# Altium schematic sheet power.SchDoc
size A4; DocumentNumber: 7; SheetNumber: 7; SheetTotal: 8
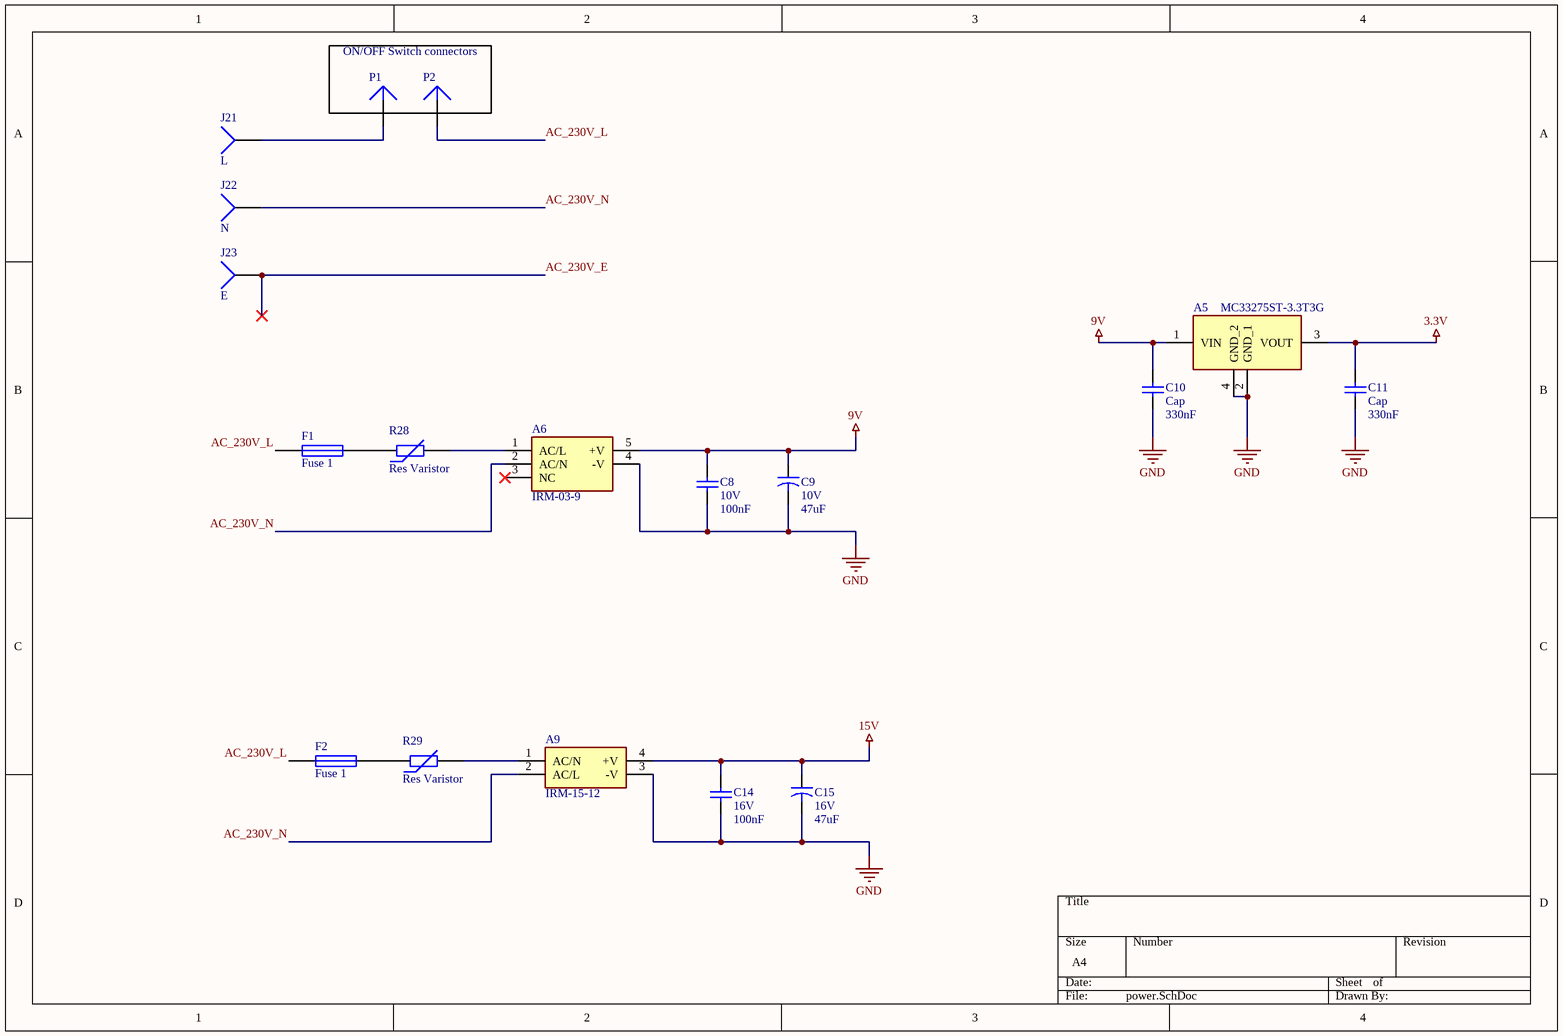
[diagram p0: power.SchDoc]

## Parts
A5  MC33275ST-3.3T3G  [SOT230P700X175-4N]
A6  IRM-03-9  [IRM039]
A9  IRM-15-12  [IRM-15-12]
C8  10V  value 100nF  [6-0805_L]
C9  10V  value 47uF  [CAPAE830X1050N]
C10  Cap  value 330nF  [6-0805_L]
C11  Cap  value 330nF  [6-0805_L]
C14  16V  value 100nF  [6-0805_L]
C15  16V  value 47uF  [CAPAE830X1050N]
F1  Fuse 1  [0751.0056]
F2  Fuse 1  [0751.0056]
J21  L  [PIN1]
J22  N  [PIN1]
J23  E  [PIN1]
P1  Plug  [PIN1]  (value not drawn)
P2  Plug  [PIN1]  (value not drawn)
R28  Res Varistor  [CAPR5-4X5]
R29  Res Varistor  [CAPR5-4X5]

## Blocks framed on the sheet
ON/OFF Switch connectors: P1 P2

## Nets
3.3V: A5.3(VOUT) C11.2
9V: A5.1(VIN) A6.5(+V) C8.2 C9.1 C10.2
15V: A9.4(+V) C14.2 C15.1
GND: A5.2(GND_1) A5.4(GND_2) A6.4(-V) A9.3(-V) C8.1 C9.2 C10.1 C11.1 C14.1 C15.2
AC_230V_E: J23.1
AC_230V_L: F1.1 F2.1 P2.1
AC_230V_N: A6.2(AC/N) A9.2(AC/L) J22.1
NetA6_1: A6.1(AC/L) R28.2
NetA9_1: A9.1(AC/N) R29.2
NetF1_2: F1.2 R28.1
NetF2_2: F2.2 R29.1
NetJ21_1: J21.1 P1.1

Not connected (* = marked no-connect by the designer): A6 3(NC)*

## Library data of the parts
A5 = MC33275ST-3.3T3G: Integrated Circuit; Manufacturer_Name: ON Semiconductor; Allied_Number: 70340056; Datasheet Link: http://www.onsemi.com/pub/Collateral/MC33275-D.PDF; Height: 1.75mm; Manufacturer_Part_Number: MC33275ST-3.3T3G; Mouser Part Number: 863-MC33275ST-3.3T3G; Mouser Price/Stock: https://www.mouser.com/Search/Refine.aspx?Keyword=863-MC33275ST-3.3T3G; RS Part Number: 7856910P; RS Price/Stock: http://uk.rs-online.com/web/p/products/7856910P; Allied Price/Stock: https://www.alliedelec.com/on-semiconductor-mc33275st-3-3t3g/70340056/
A6 = IRM-03-9: Power Supply; Manufacturer_Name: Mean Well; Allied_Number: 70879802; Datasheet Link: https://componentsearchengine.com/Datasheets/2/IRM-03-9.pdf; Height: 15mm; Manufacturer_Part_Number: IRM-03-9; Mouser Part Number: 709-IRM03-9; Mouser Price/Stock: https://www.mouser.com/Search/Refine.aspx?Keyword=709-IRM03-9; RS Part Number: 1359235P; RS Price/Stock: http://uk.rs-online.com/web/p/products/1359235P; Allied Price/Stock: https://www.alliedelec.com/meanwellusa-irm-03-9/70879802/
A9 = IRM-15-12: Power Supply; Manufacturer_Name: Mean Well; Datasheet Link: https://www.meanwell-web.com/content/files/pdfs/productPdfs/MW/IRM-15-spec.pdf; Mouser2 Part Number: 709-IRM15-12; Mouser2 Price/Stock: https://www.mouser.com/Search/Refine.aspx?Keyword=709-IRM15-12; Manufacturer_Part_Number: IRM-15-12
C8 C10 C11 C14 = Cap: Capacitor; Published: 8-Jun-2000; LatestRevisionDate: 17-Jul-2002; LatestRevisionNote: Re-released for DXP Platform.; PackageReference: RAD-0.3; Publisher: Altium Limited; PackageDescription: Radial Cap, Thru-Hole; 2 Leads; 0.3 in Pin Spacing
C9 C15 = Cap2: Capacitor; Published: 23-Sep-2002; PackageReference: CAPR5-4X5; Publisher: Altium Limited; PackageDescription: Capacitor; 2 Leads
F1 F2 = Fuse 1: Fuse; Published: 8-Jun-2000; LatestRevisionDate: 17-Jul-2002; LatestRevisionNote: Re-released for DXP Platform.; PackageReference: PIN-W2/E2.8; Publisher: Altium Limited; PackageDescription: Thru-Hole; 2 Leads
J21-J23 = Socket: LatestRevisionDate: 17-Jul-2002; LatestRevisionNote: Re-released for DXP Platform.; Publisher: Altium Limited
R28 R29 = Res Varistor: Varistor (Voltage-Sensitive Resistor); Published: 24-Mar-1999; LatestRevisionDate: 29-May-2009; LatestRevisionNote: IPC-7351 Footprint Added.; PackageVersion: Mar-2003; PackageReference: 6-0805; Publisher: Altium Limited; PackageDescription: Chip Resistor 0805 Case Size; Code_IPC: RESC2012
P1 P2 = Plug: LatestRevisionDate: 17-Jul-2002; LatestRevisionNote: Re-released for DXP Platform.; Publisher: Altium Limited